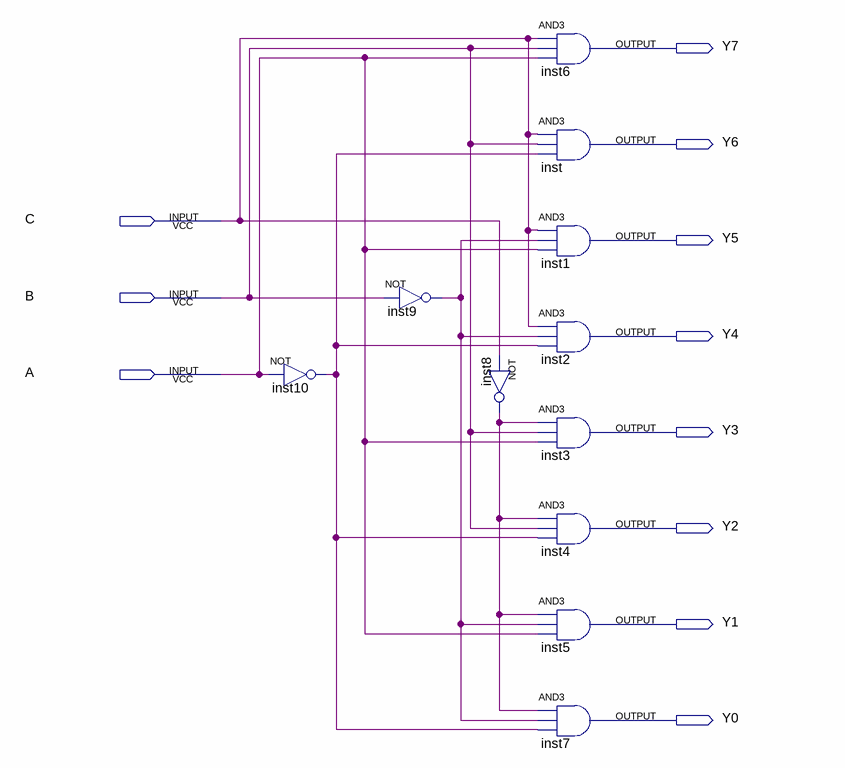
[diagram p0: schematic sheet]
// Quartus schematic 38trans.bdf as structural Verilog: 11 symbols, 11 pins
module \38trans  (
  input  C,
  input  B,
  input  A,
  output Y7,
  output Y6,
  output Y5,
  output Y4,
  output Y3,
  output Y2,
  output Y1,
  output Y0
);

  wire inst8_out, inst9_out, inst10_out;

  not inst10 (inst10_out, A);
  not inst9 (inst9_out, B);
  not inst8 (inst8_out, C);
  and inst6 (Y7, C, B, A);
  and inst (Y6, C, B, inst10_out);
  and inst1 (Y5, C, inst9_out, A);
  and inst2 (Y4, C, inst9_out, inst10_out);
  and inst3 (Y3, inst8_out, B, A);
  and inst4 (Y2, inst8_out, B, inst10_out);
  and inst5 (Y1, inst8_out, inst9_out, A);
  and inst7 (Y0, inst8_out, inst9_out, inst10_out);
endmodule
